# EAGLE design blinky (EAGLE 6.4)
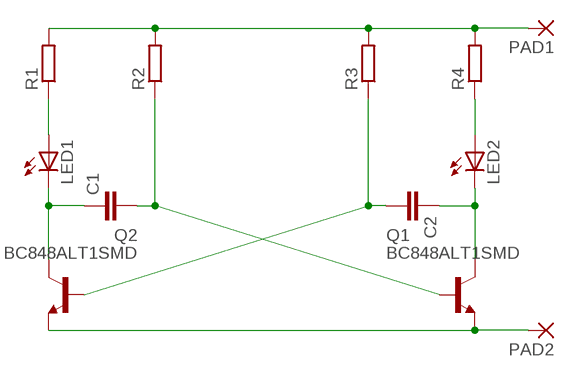
[diagram p0: schematic, sheet 1]

## Parts
C1  C-EUC0805  [C0805]
C2  C-EUC0805  [C0805]
LED1  LEDCHIP-LED0805  [CHIP-LED0805]
LED2  LEDCHIP-LED0805  [CHIP-LED0805]
PAD1  2,54/1,0  [2,54/1,0]
PAD2  2,54/1,0  [2,54/1,0]
Q1  BC848ALT1SMD  [SOT23]
Q2  BC848ALT1SMD  [SOT23]
R1  R-EU_R0805  [R0805]
R2  R-EU_R0805  [R0805]
R3  R-EU_R0805  [R0805]
R4  R-EU_R0805  [R0805]

## Nets
N$1: C1.2 Q1.1(B) R2.1
N$2: LED1.A R1.1
N$3: PAD1.1(P) R1.2 R2.2 R3.2 R4.2
N$4: PAD2.1(P) Q1.2(E) Q2.2(E)
N$5: C1.1 LED1.C Q2.3(C)
N$6: C2.2 Q2.1(B) R3.1
N$7: C2.1 LED2.C Q1.3(C)
N$8: LED2.A R4.1

## Library data of the parts
C1 C2 = rcl:C-EU: CAPACITOR, European symbol
LED1 LED2 = led:LED: LED OSRAM: - CHIPLED LG R971, LG N971, LY N971, LG Q971, LY Q971, LO R971, LY R971 LH N974, LH R974 LS Q976, LO Q976, LY Q976 LO Q996 - Hyper CHIPLED LW Q18S LB Q993, LB Q99A, LB R99A - SideLED LS A670, LO A670, LY A670, LG A670, LP A670 LB A673, LV A673, LT A673, LW A673 LH A674 LY A675 LS A676, LA A676, LO A676, LY A676, LW A676 LS A679, LY A679, LG A679 - Hyper Micro SIDELED® LS Y876, LA Y876, LO Y876, LY Y876 LT Y87S - SmartLED LW L88C, LW L88S LB L89C, LB L89S, LG L890 LS L89K, LO L89K, LY L89K LS L896, LA L896, LO L896, LY L896 - TOPLED LS T670, LO T670, LY T670, LG T670, LP T670 LSG T670, LSP T670, LSY T670, LOP T670, LYG T670 LG T671, LOG T671, LSG T671 LB T673, LV T673, LT T673, LW T673 LH T674 LS T676, LA T676, LO T676, LY T676, LB T676, LH T676, LSB T676, LW T676 LB T67C, LV T67C, LT T67C, LS T67K, LO T67K, LY T67K, LW E67C LS E67B, LA E67B, LO E67B, LY E67B, LB E67C, LV E67C, LT E67C LW T67C LS T679, LY T679, LG T679 LS T770, LO T770, LY T770, LG T770, LP T770 LB T773, LV T773, LT T773, LW T773 LH T774 LS E675, LA E675, LY E675, LS T675 LS T776, LA T776, LO T776, LY T776, LB T776 LHGB T686 LT T68C, LB T68C - Hyper Mini TOPLED® LB M676 - Mini TOPLED Santana® LG M470 LS M47K, LO M47K, LY M47K Source: http://www.osram.convergy.de LUXEON: - LUMILED® LXK2-PW12-R00, LXK2-PW12-S00, LXK2-PW14-U00, LXK2-PW14-V00 LXK2-PM12-R00, LXK2-PM12-S00, LXK2-PM14-U00 LXK2-PE12-Q00, LXK2-PE12-R00, LXK2-PE12-S00, LXK2-PE14-T00, LXK2-PE14-U00 LXK2-PB12-K00, LXK2-PB12-L00, LXK2-PB12-M00, LXK2-PB14-N00, LXK2-PB14-P00, LXK2-PB14-Q00 LXK2-PR12-L00, LXK2-PR12-M00, LXK2-PR14-Q00, LXK2-PR14-R00 LXK2-PD12-Q00, LXK2-PD12-R00, LXK2-PD12-S00 LXK2-PH12-R00, LXK2-PH12-S00 LXK2-PL12-P00, LXK2-PL12-Q00, LXK2-PL12-R00 Source: www.luxeon.com KINGBRIGHT: KA-3528ASYC Source: www.kingbright.com
PAD1 PAD2 = wirepad:2,54/1,0: THROUGH-HOLE PAD
Q1 Q2 = transistor-npn:BC848*: NPN Transistor
R1-R4 = rcl:R-EU_: RESISTOR, European symbol

## Board
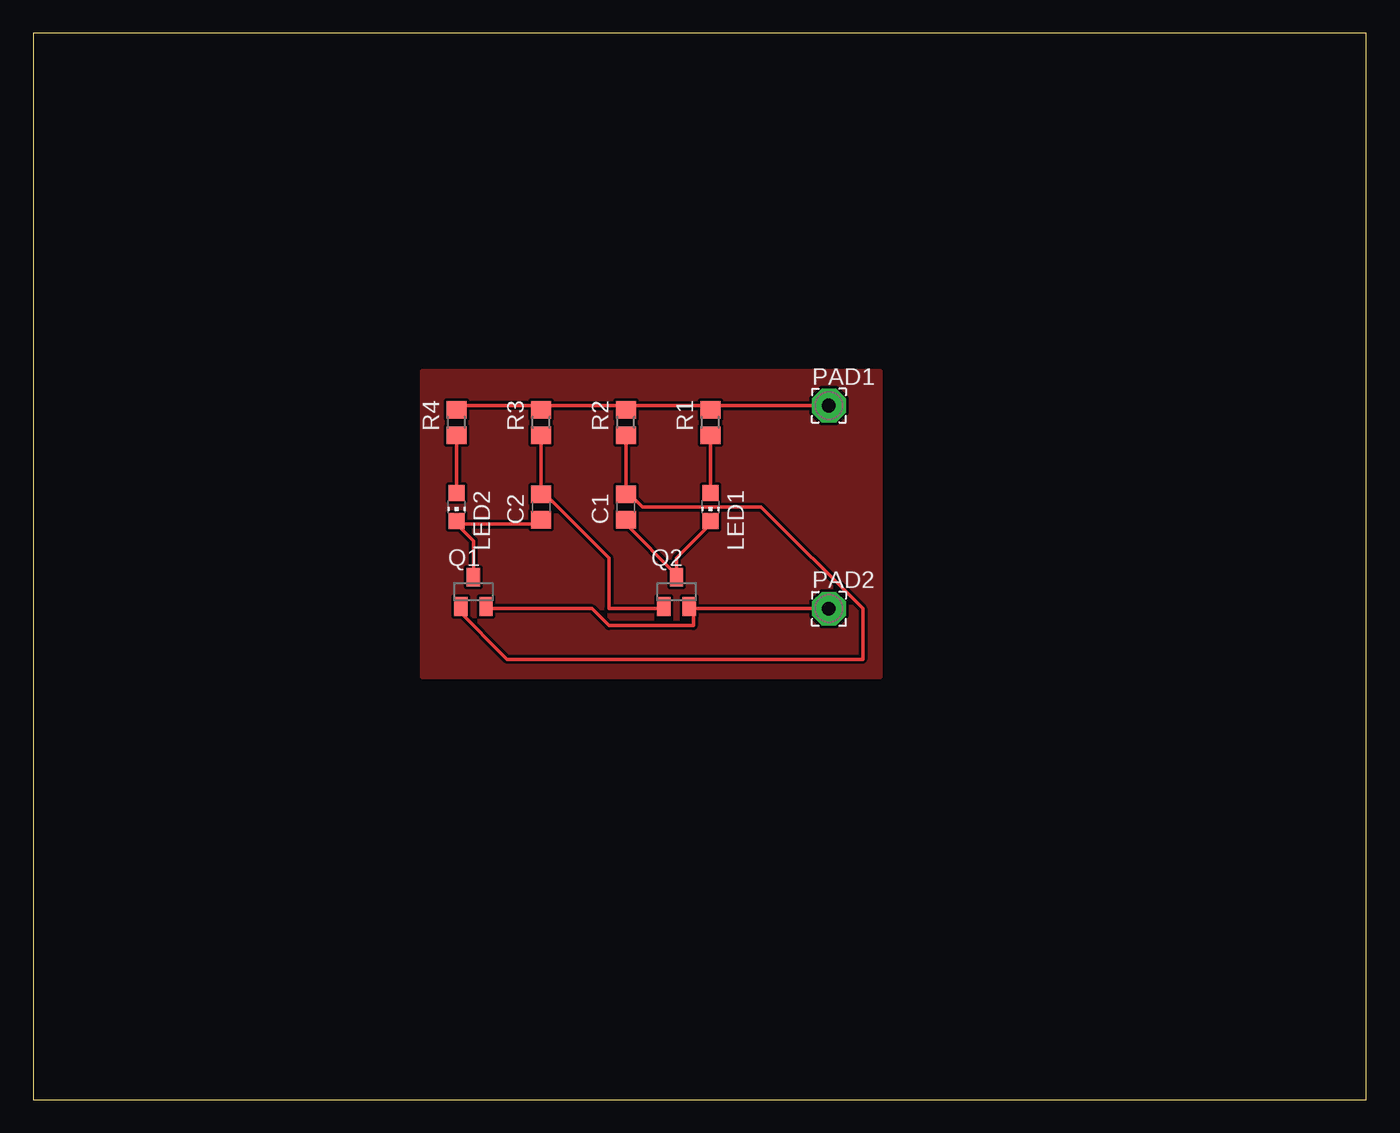
[diagram p1: board, top side]

Size 100 x 80 mm. Coordinates in mm from the lower left corner, seen from the top.
Outline: 0,0 100,0 100,80 0,80 0,0
Copper layers (1*16): Top 0.035mm / dielectric 1.5mm / Bottom 0.035mm
Design rules "default": minimum track width 10mil, minimum drill 24mil, track to track 8mil, track to pad 8mil, pad to pad 8mil, via to via 8mil, smd to smd 8mil, copper to edge 40mil, drill to drill 8mil, minimum pad ring 10mil, minimum via ring 8mil, stop-mask expansion 4mil, vias tented up to drill 0mil, thermal gap 10mil

### Footprints (pad centres in the part's own frame; a part is rotated, then mirrored left to right if it is on the bottom)
C0805 = smd 1.3 x 1.5: 1 -0.95,0; 2 0.95,0
CHIP-LED0805 = smd 1.2 x 1.2: A 0,-1.05; C 0,1.05
2,54/1,0 = drill 1.016 pad 2.54 octagon: 1 0,0
SOT23 = smd 1 x 1.4: 1 -0.95,-1.1; 2 0.95,-1.1; 3 0,1.1
R0805 = smd 1.3 x 1.5: 1 -0.95,0; 2 0.95,0

### Placement (x,y rotation side)
C1  44.45,44.45 90 top
C2  38.1,44.45 90 top
LED1  50.8,44.45 180 top
LED2  31.75,44.45 180 top
PAD1  59.69,52.07 0 top
PAD2  59.69,36.83 0 top
Q1  33.02,38.1 0 top
Q2  48.26,38.1 0 top
R1  50.8,50.8 90 top
R2  44.45,50.8 90 top
R3  38.1,50.8 90 top
R4  31.75,50.8 90 top

### Tracks (layer width: path | path; a pad name or v marks a point on that pad's centre or on a via)
N$1
  Top 0.254: 44.45,45.72 45.72,44.45 54.61,44.45 62.23,36.83 62.23,33.02 35.56,33.02 31.75,36.83 Q1.1 | 44.45,45.72 R2.1 | 44.45,45.72 C1.2
N$2
  Top 0.254: R1.1 LED1.A
N$3
  Top 0.254: 38.1,52.07 31.75,52.07 R4.2 | 38.1,52.07 44.45,52.07 | 38.1,52.07 R3.2 | 44.45,52.07 50.8,52.07 | 44.45,52.07 R2.2 | 50.8,52.07 PAD1.1 | 50.8,52.07 R1.2
N$4
  Top 0.254: 49.53,36.83 49.53,35.56 43.18,35.56 41.91,36.83 34.29,36.83 Q1.2 | 49.53,36.83 PAD2.1 | 49.53,36.83 Q2.2
N$5
  Top 0.254: 48.26,39.37 48.26,40.64 50.8,43.18 LED1.C | 48.26,39.37 44.45,43.18 C1.1 | 48.26,39.37 Q2.3
N$6
  Top 0.254: 38.1,45.72 43.18,40.64 43.18,36.83 46.99,36.83 Q2.1 | 38.1,45.72 R3.1 | 38.1,45.72 C2.2
N$7
  Top 0.254: 31.75,43.18 33.02,41.91 Q1.3 | 31.75,43.18 38.1,43.18 C2.1 | 31.75,43.18 LED2.C
N$8
  Top 0.254: R4.1 LED2.A
N$9
  pour Top: 29.21,54.61 29.21,31.75 63.5,31.75 63.5,54.61